# Altium schematic sheet Controller.SchDoc
size A4; SheetNumber: 5; SheetTotal: 5
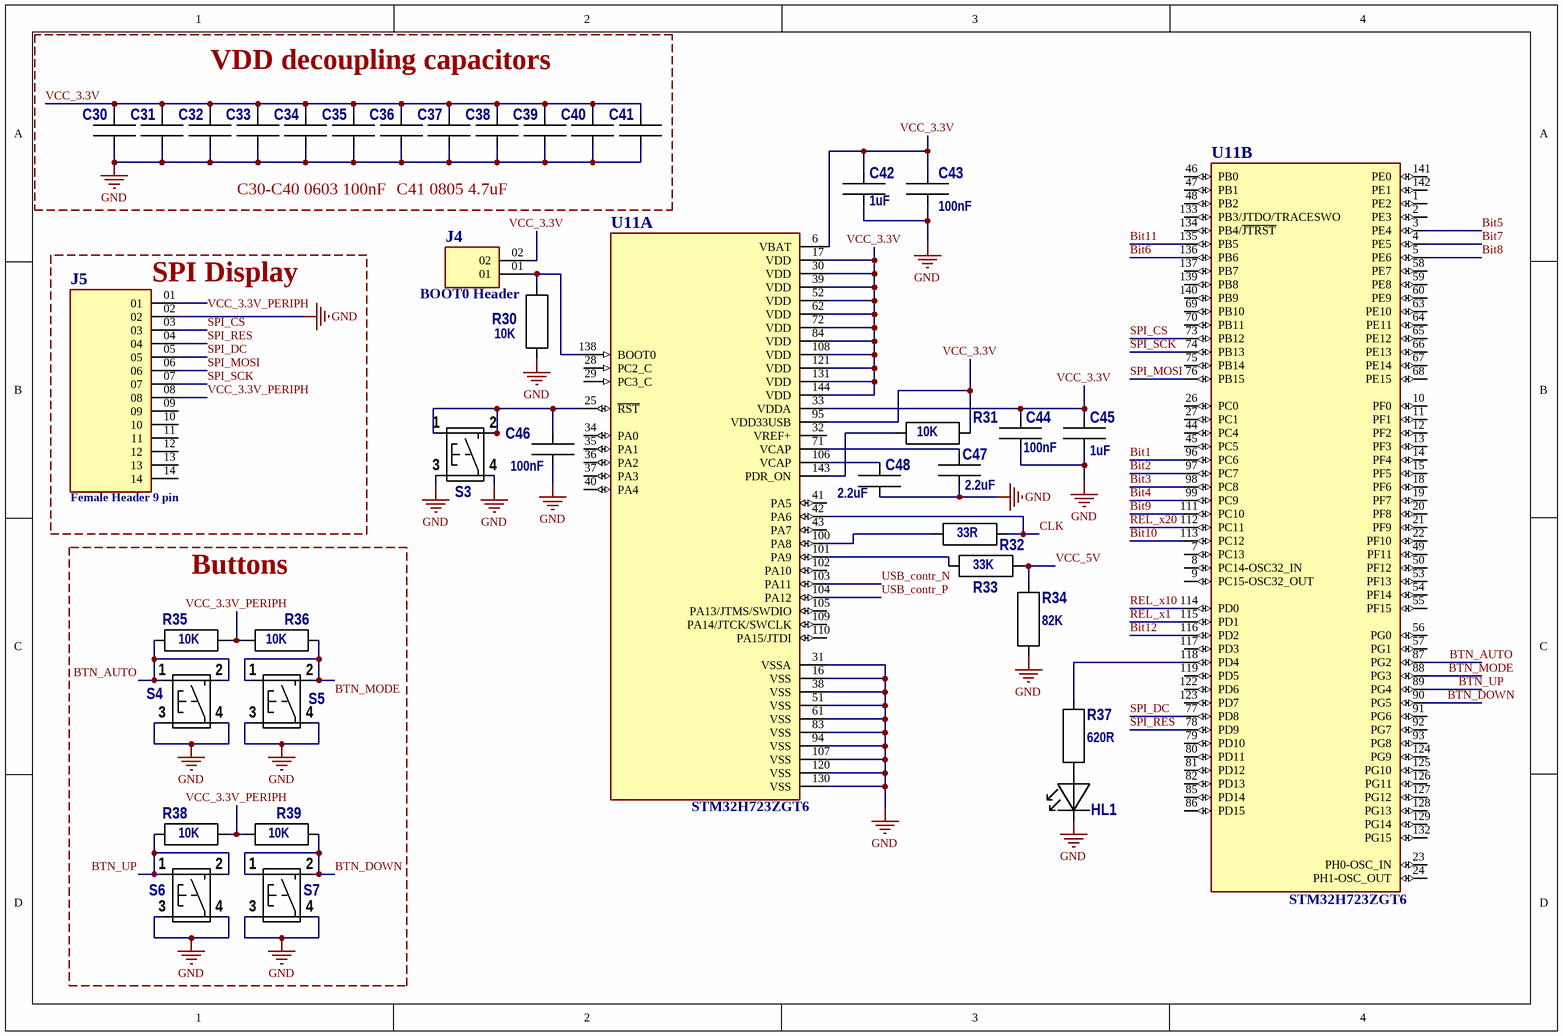
[diagram p0: Controller.SchDoc]

## Parts
C30  100nF  [CAP 0603 3D]  (value not drawn)
C31  100nF  [CAP 0603 3D]  (value not drawn)
C32  100nF  [CAP 0603 3D]  (value not drawn)
C33  100nF  [CAP 0603 3D]  (value not drawn)
C34  100nF  [CAP 0603 3D]  (value not drawn)
C35  100nF  [CAP 0603 3D]  (value not drawn)
C36  100nF  [CAP 0603 3D]  (value not drawn)
C37  100nF  [CAP 0603 3D]  (value not drawn)
C38  100nF  [CAP 0603 3D]  (value not drawn)
C39  100nF  [CAP 0603 3D]  (value not drawn)
C40  100nF  [CAP 0603 3D]  (value not drawn)
C41  4.7uF  [Cap 0805 3D]  (value not drawn)
C42  1uF  [Cap 0805 3D]
C43  100nF  [CAP 0603 3D]
C44  100nF  [CAP 0603 3D]
C45  1uF  [Cap 0805 3D]
C46  100nF  [CAP 0603 3D]
C47  2.2uF  [Cap 0805 3D]
C48  2.2uF  [Cap 0805 3D]
HL1  fyls-0805???  [СД_SMD 2012_110]  (value not drawn)
J4  BOOT0 Header  [SAMTEC_HTSW-102-07-TM-S]
J5  Female Header 9 pin  [SAMTEC_SSQ-114-02-T-S]
R30  10K  [Res_0603 3D]
R31  10K  [Res_0603 3D]
R32  33R  [Res_0603 3D]
R33  33K  [Res_0603 3D]
R34  82K  [Res_0603 3D]
R35  10K  [Res_0603 3D]
R36  10K  [Res_0603 3D]
R37  620R  [Res_0603 3D]
R38  10K  [Res_0603 3D]
R39  10K  [Res_0603 3D]
S3  SWT-20-12.5  [250 _ 6,0-6,0-12,5]  (value not drawn)
S4  SWT-20-12.5  [250 _ 6,0-6,0-12,5]  (value not drawn)
S5  SWT-20-12.5  [250 _ 6,0-6,0-12,5]  (value not drawn)
S6  SWT-20-12.5  [250 _ 6,0-6,0-12,5]  (value not drawn)
S7  SWT-20-12.5  [250 _ 6,0-6,0-12,5]  (value not drawn)
U11  STM32H723ZGT6  [QFP50P2200X2200X160-144N]  (parts A,B of 2)

## Blocks framed on the sheet
VDD decoupling capacitors: C30-C41
SPI Display: J5
Buttons: R35 R36 R38 R39 S4-S7

## Nets
GND: C30.1 C31.1 C32.1 C33.1 C34.1 C35.1 C36.1 C37.1 C38.1 C39.1 C40.2 C41.1 C42.1 C43.2 C44.2 C45.1 C46.2 C47.1 C48.1 HL1.1(K) J5.02 R30.1 R34.2 S3.3 S3.4 S4.3 S4.4 S5.3 S5.4 S6.3 S6.4 S7.3 S7.4 U11.16(VSS) U11.31(VSSA) U11.38(VSS) U11.51(VSS) U11.61(VSS) U11.83(VSS) U11.94(VSS) U11.107(VSS) U11.120(VSS) U11.130(VSS)
Bit1: U11.96(PC6)
Bit2: U11.97(PC7)
Bit3: U11.98(PC8)
Bit4: U11.99(PC9)
Bit5: U11.3(PE4)
Bit6: U11.136(PB6)
Bit7: U11.4(PE5)
Bit8: U11.5(PE6)
Bit9: U11.111(PC10)
Bit10: U11.113(PC12)
Bit11: U11.135(PB5)
Bit12: U11.116(PD2)
BTN_AUTO: R35.2 S4.1 S4.2 U11.87(PG2)
BTN_DOWN: R39.1 S7.1 S7.2 U11.90(PG5)
BTN_MODE: R36.1 S5.1 S5.2 U11.88(PG3)
BTN_UP: R38.2 S6.1 S6.2 U11.89(PG4)
CLK: R32.1 U11.42(PA6)
REL_x1: U11.115(PD1)
REL_x10: U11.114(PD0)
REL_x20: U11.112(PC11)
SPI_CS: J5.03 U11.73(PB12)
SPI_DC: J5.05 U11.77(PD8)
SPI_MOSI: J5.06 U11.76(PB15)
SPI_RES: J5.04 U11.78(PD9)
SPI_SCK: J5.07 U11.74(PB13)
USB_contr_N: U11.103(PA11)
USB_contr_P: U11.104(PA12)
VCC_3.3V: C30.2 C31.2 C32.2 C33.2 C34.2 C35.2 C36.2 C37.2 C38.2 C39.2 C40.1 C41.2 C42.2 C43.1 C44.1 C45.2 J4.02 R31.1 U11.6(VBAT) U11.17(VDD) U11.30(VDD) U11.33(VDDA) U11.39(VDD) U11.52(VDD) U11.62(VDD) U11.72(VDD) U11.84(VDD) U11.95(VDD33USB) U11.108(VDD) U11.121(VDD) U11.131(VDD) U11.144(VDD)
VCC_3.3V_PERIPH: J5.01 J5.08 R35.1 R36.2 R38.1 R39.2
VCC_5V: R33.1 R34.1
NetC46_1: C46.1 S3.1 S3.2 U11.25(~{RST})
NetC47_2: C47.2 U11.71(VCAP)
NetC48_2: C48.2 U11.106(VCAP)
NetHL1_2: HL1.2(A) R37.2
NetJ4_01: J4.01 R30.2 U11.138(BOOT0)
NetR31_2: R31.2 U11.143(PDR_ON)
NetR32_2: R32.2 U11.100(PA8)
NetR33_2: R33.2 U11.101(PA9)
NetR37_1: R37.1 U11.118(PD4)

Not connected (* = marked no-connect by the designer): J5 09 10 11 12 13 14; U11 1(PE2) 2(PE3) 7(PC13) 8(PC14-OSC32_IN) 9(PC15-OSC32_OUT) 10(PF0) 11(PF1) 12(PF2) 13(PF3) 14(PF4) 15(PF5) 18(PF6) 19(PF7) 20(PF8) 21(PF9) 22(PF10) 23(PH0-OSC_IN) 24(PH1-OSC_OUT) 26(PC0) 27(PC1) 28(PC2_C) 29(PC3_C) 32(VREF+) 34(PA0) 35(PA1) 36(PA2) 37(PA3) 40(PA4) 41(PA5) 43(PA7) 44(PC4) 45(PC5) 46(PB0) 47(PB1) 48(PB2) 49(PF11) 50(PF12) 53(PF13) 54(PF14) 55(PF15) 56(PG0) 57(PG1) 58(PE7) 59(PE8) 60(PE9) 63(PE10) 64(PE11) 65(PE12) 66(PE13) 67(PE14) 68(PE15) 69(PB10) 70(PB11) 75(PB14) 79(PD10) 80(PD11) 81(PD12) 82(PD13) 85(PD14) 86(PD15) 91(PG6) 92(PG7) 93(PG8) 102(PA10) 105(PA13/JTMS/SWDIO) 109(PA14/JTCK/SWCLK) 110(PA15/JTDI) 117(PD3) 119(PD5) 122(PD6) 123(PD7) 124(PG9) 125(PG10) 126(PG11) 127(PG12) 128(PG13) 129(PG14) 132(PG15) 133(PB3/JTDO/TRACESWO) 134(PB4/~{JTRST}) 137(PB7) 139(PB8) 140(PB9) 141(PE0) 142(PE1)

## Notes on the sheet
- C30-C40 0603 100nF
- C41 0805 4.7uF

## Library data of the parts
C30-C40 = C: 0805 100nF X7R
C41 = C: 0805 4.7 uF min 6V
C42 = C: 0805 1uF min 6V
C43 C44 C46 = C: 0603 100nF X7R
C45 = C: 0805 1 uF X7R
C47 C48 = C: 0805 2.2 uF X7R ESR<100 mOhm
HL1 = fyls-0805....: Св. д. ЧИП 2012 (0805)
J4 = HTSW-102-07-TM-S: HEADER, 2 CONTACTS, 1 ROW, THROUGH HOLE, 2.54 MM; Connector Systems:Board-to-Board; Pitch Spacing:2.54mm; No. of Rows:1Rows; No. of Contacts:2Contacts; Contact Termination Type:Through Hole; Product Range:HTSW Series; Gender:Header RoHS Compliant: Yes; MP: HTSW10207TMS; MF: Samtec; SnapEDA_Link: https://www.snapeda.com/parts/HTSW10207TMS/Samtec/view-part/?ref=snap; Value: *; Purchase-URL: https://pricing.snapeda.com/search/part/HTSW10207TMS/?ref=eda; Availability: In Stock; Check_prices: https://www.snapeda.com/parts/HTSW10207TMS/Samtec/view-part/?ref=eda; Package: None; Price: None
J5 = SSQ-114-02-T-S: CONNECTOR, RECEPTACLE, 14 CONTACTS, 1 ROW, THROUGH HOLE, 2.54 MM; Connector Systems:Board-to-Board; Pitch Spacing:2.54mm; No. of Rows:1Rows; No. of Contacts:14Contacts; Connector Mounting:Through Hole Mount; Product Range:SSQ Series RoHS Compliant: Yes; MF: Samtec; MP: SSQ11402TS; Check_prices: https://www.snapeda.com/parts/SSQ11402TS/Samtec/view-part/?ref=eda; Package: None; Value: *; Price: None; Availability: In Stock; SnapEDA_Link: https://www.snapeda.com/parts/SSQ11402TS/Samtec/view-part/?ref=snap; Purchase-URL: https://pricing.snapeda.com/search/part/SSQ11402TS/?ref=eda
R30 R33-R36 R38 R39 = R: 0603 1%
R31 R37 = R: 0603 1% 620R
R32 = R: 0603 0.1%
S3-S7 = 1_SWT-20-12.5: Кнопка тактовая
U11 = STM32H723ZGT6: ARMÂ® CortexÂ®-M7 STM32H7 Microcontroller IC 32-Bit Single-Core 550MHz 1MB (1M x 8) FLASH 144-LQFP (20x20); MF: STMicroelectronics; SnapEDA_Link: https://www.snapeda.com/parts/STM32H723ZGT6/STMicroelectronics/view-part/?ref=snap; Package: LQFP-144 STMicroelectronics; Value: *; MP: STM32H723ZGT6; Check_prices: https://www.snapeda.com/parts/STM32H723ZGT6/STMicroelectronics/view-part/?ref=eda